# Altium project Street_light_LED.PrjPcb
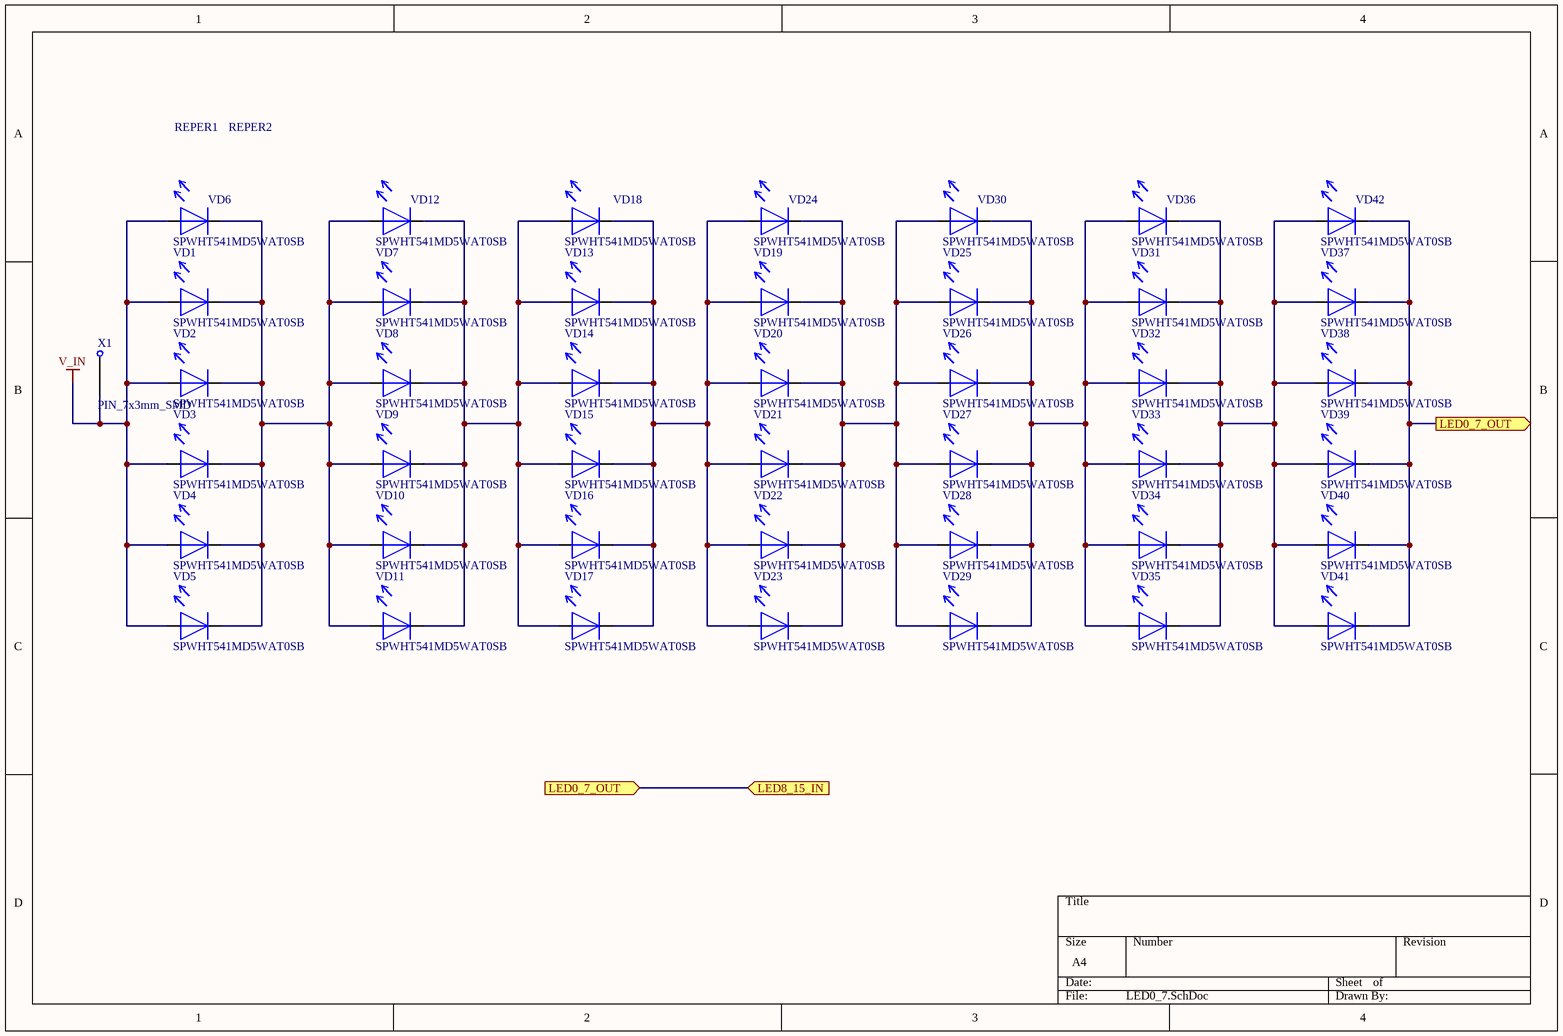
[diagram p0: LED0_7.SchDoc]
4 sheets, 160 parts. Net scope: flat (ports and power ports of the same name join across sheets).
Board file: Street_light_LED.PcbDoc
Sheets:
  LED0_7.SchDoc
  LED8_15.SchDoc
  LED16_23.SchDoc
  LED24_26.SchDoc

## Sheet LED0_7.SchDoc
size A4

### Parts
REPER1  REPER1.2  [REPER1.2]  (value not drawn)
REPER2  REPER1.2  [REPER1.2]  (value not drawn)
VD1  SPWHT541MD5WAT0SB  [LED_SAMSUNG]
VD2  SPWHT541MD5WAT0SB  [LED_SAMSUNG]
VD3  SPWHT541MD5WAT0SB  [LED_SAMSUNG]
VD4  SPWHT541MD5WAT0SB  [LED_SAMSUNG]
VD5  SPWHT541MD5WAT0SB  [LED_SAMSUNG]
VD6  SPWHT541MD5WAT0SB  [LED_SAMSUNG]
VD7  SPWHT541MD5WAT0SB  [LED_SAMSUNG]
VD8  SPWHT541MD5WAT0SB  [LED_SAMSUNG]
VD9  SPWHT541MD5WAT0SB  [LED_SAMSUNG]
VD10  SPWHT541MD5WAT0SB  [LED_SAMSUNG]
VD11  SPWHT541MD5WAT0SB  [LED_SAMSUNG]
VD12  SPWHT541MD5WAT0SB  [LED_SAMSUNG]
VD13  SPWHT541MD5WAT0SB  [LED_SAMSUNG]
VD14  SPWHT541MD5WAT0SB  [LED_SAMSUNG]
VD15  SPWHT541MD5WAT0SB  [LED_SAMSUNG]
VD16  SPWHT541MD5WAT0SB  [LED_SAMSUNG]
VD17  SPWHT541MD5WAT0SB  [LED_SAMSUNG]
VD18  SPWHT541MD5WAT0SB  [LED_SAMSUNG]
VD19  SPWHT541MD5WAT0SB  [LED_SAMSUNG]
VD20  SPWHT541MD5WAT0SB  [LED_SAMSUNG]
VD21  SPWHT541MD5WAT0SB  [LED_SAMSUNG]
VD22  SPWHT541MD5WAT0SB  [LED_SAMSUNG]
VD23  SPWHT541MD5WAT0SB  [LED_SAMSUNG]
VD24  SPWHT541MD5WAT0SB  [LED_SAMSUNG]
VD25  SPWHT541MD5WAT0SB  [LED_SAMSUNG]
VD26  SPWHT541MD5WAT0SB  [LED_SAMSUNG]
VD27  SPWHT541MD5WAT0SB  [LED_SAMSUNG]
VD28  SPWHT541MD5WAT0SB  [LED_SAMSUNG]
VD29  SPWHT541MD5WAT0SB  [LED_SAMSUNG]
VD30  SPWHT541MD5WAT0SB  [LED_SAMSUNG]
VD31  SPWHT541MD5WAT0SB  [LED_SAMSUNG]
VD32  SPWHT541MD5WAT0SB  [LED_SAMSUNG]
VD33  SPWHT541MD5WAT0SB  [LED_SAMSUNG]
VD34  SPWHT541MD5WAT0SB  [LED_SAMSUNG]
VD35  SPWHT541MD5WAT0SB  [LED_SAMSUNG]
VD36  SPWHT541MD5WAT0SB  [LED_SAMSUNG]
VD37  SPWHT541MD5WAT0SB  [LED_SAMSUNG]
VD38  SPWHT541MD5WAT0SB  [LED_SAMSUNG]
VD39  SPWHT541MD5WAT0SB  [LED_SAMSUNG]
VD40  SPWHT541MD5WAT0SB  [LED_SAMSUNG]
VD41  SPWHT541MD5WAT0SB  [LED_SAMSUNG]
VD42  SPWHT541MD5WAT0SB  [LED_SAMSUNG]
X1  PIN_7x3mm_SMD  [PIN_7x3mm_SMD]

### Ports
LED0_7_OUT (in), LED0_7_OUT (out), LED8_15_IN (in)

### Nets
V_IN: VD1.1 VD2.1 VD3.1 VD4.1 VD5.1 VD6.1 X1.1
NetVD1_2: VD1.2 VD2.2 VD3.2 VD4.2 VD5.2 VD6.2 VD7.1 VD8.1 VD9.1 VD10.1 VD11.1 VD12.1
NetVD7_2: VD7.2 VD8.2 VD9.2 VD10.2 VD11.2 VD12.2 VD13.1 VD14.1 VD15.1 VD16.1 VD17.1 VD18.1
NetVD13_2: VD13.2 VD14.2 VD15.2 VD16.2 VD17.2 VD18.2 VD19.1 VD20.1 VD21.1 VD22.1 VD23.1 VD24.1
NetVD19_2: VD19.2 VD20.2 VD21.2 VD22.2 VD23.2 VD24.2 VD25.1 VD26.1 VD27.1 VD28.1 VD29.1 VD30.1
NetVD25_2: VD25.2 VD26.2 VD27.2 VD28.2 VD29.2 VD30.2 VD31.1 VD32.1 VD33.1 VD34.1 VD35.1 VD36.1
NetVD31_2: VD31.2 VD32.2 VD33.2 VD34.2 VD35.2 VD36.2 VD37.1 VD38.1 VD39.1 VD40.1 VD41.1 VD42.1
NetVD37_2: VD37.2 VD38.2 VD39.2 VD40.2 VD41.2 VD42.2 ; port LED0_7_OUT, port LED8_15_IN

Not connected (* = marked no-connect by the designer): REPER1 1; REPER2 1

### Library data of the parts
VD1-VD42 = LED SPWHT541MD5WAT0SB: Value: SPWHT541MD5WAT0SB
REPER1 REPER2 = REPER1.2: Value: *

## Sheet LED8_15.SchDoc
size A4
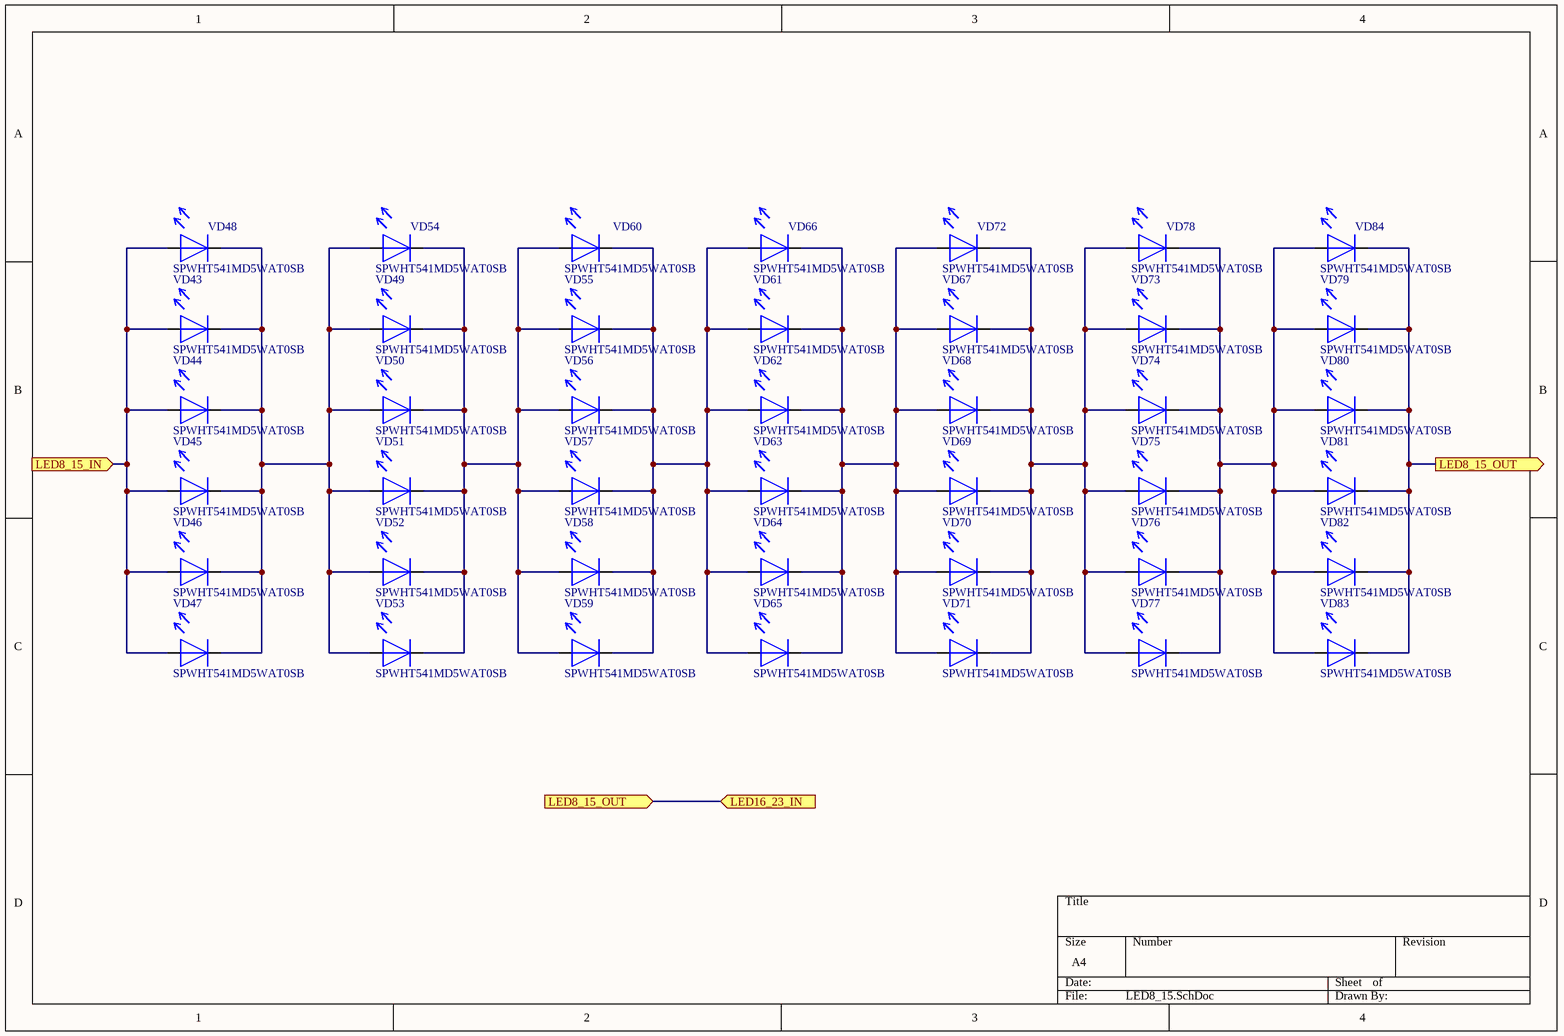
[diagram p1: LED8_15.SchDoc]

### Parts
VD43  SPWHT541MD5WAT0SB  [LED_SAMSUNG]
VD44  SPWHT541MD5WAT0SB  [LED_SAMSUNG]
VD45  SPWHT541MD5WAT0SB  [LED_SAMSUNG]
VD46  SPWHT541MD5WAT0SB  [LED_SAMSUNG]
VD47  SPWHT541MD5WAT0SB  [LED_SAMSUNG]
VD48  SPWHT541MD5WAT0SB  [LED_SAMSUNG]
VD49  SPWHT541MD5WAT0SB  [LED_SAMSUNG]
VD50  SPWHT541MD5WAT0SB  [LED_SAMSUNG]
VD51  SPWHT541MD5WAT0SB  [LED_SAMSUNG]
VD52  SPWHT541MD5WAT0SB  [LED_SAMSUNG]
VD53  SPWHT541MD5WAT0SB  [LED_SAMSUNG]
VD54  SPWHT541MD5WAT0SB  [LED_SAMSUNG]
VD55  SPWHT541MD5WAT0SB  [LED_SAMSUNG]
VD56  SPWHT541MD5WAT0SB  [LED_SAMSUNG]
VD57  SPWHT541MD5WAT0SB  [LED_SAMSUNG]
VD58  SPWHT541MD5WAT0SB  [LED_SAMSUNG]
VD59  SPWHT541MD5WAT0SB  [LED_SAMSUNG]
VD60  SPWHT541MD5WAT0SB  [LED_SAMSUNG]
VD61  SPWHT541MD5WAT0SB  [LED_SAMSUNG]
VD62  SPWHT541MD5WAT0SB  [LED_SAMSUNG]
VD63  SPWHT541MD5WAT0SB  [LED_SAMSUNG]
VD64  SPWHT541MD5WAT0SB  [LED_SAMSUNG]
VD65  SPWHT541MD5WAT0SB  [LED_SAMSUNG]
VD66  SPWHT541MD5WAT0SB  [LED_SAMSUNG]
VD67  SPWHT541MD5WAT0SB  [LED_SAMSUNG]
VD68  SPWHT541MD5WAT0SB  [LED_SAMSUNG]
VD69  SPWHT541MD5WAT0SB  [LED_SAMSUNG]
VD70  SPWHT541MD5WAT0SB  [LED_SAMSUNG]
VD71  SPWHT541MD5WAT0SB  [LED_SAMSUNG]
VD72  SPWHT541MD5WAT0SB  [LED_SAMSUNG]
VD73  SPWHT541MD5WAT0SB  [LED_SAMSUNG]
VD74  SPWHT541MD5WAT0SB  [LED_SAMSUNG]
VD75  SPWHT541MD5WAT0SB  [LED_SAMSUNG]
VD76  SPWHT541MD5WAT0SB  [LED_SAMSUNG]
VD77  SPWHT541MD5WAT0SB  [LED_SAMSUNG]
VD78  SPWHT541MD5WAT0SB  [LED_SAMSUNG]
VD79  SPWHT541MD5WAT0SB  [LED_SAMSUNG]
VD80  SPWHT541MD5WAT0SB  [LED_SAMSUNG]
VD81  SPWHT541MD5WAT0SB  [LED_SAMSUNG]
VD82  SPWHT541MD5WAT0SB  [LED_SAMSUNG]
VD83  SPWHT541MD5WAT0SB  [LED_SAMSUNG]
VD84  SPWHT541MD5WAT0SB  [LED_SAMSUNG]

### Ports
LED8_15_IN (in), LED8_15_OUT (in), LED8_15_OUT (out), LED16_23_IN (in)

### Nets
NetVD37_2: VD43.1 VD44.1 VD45.1 VD46.1 VD47.1 VD48.1 ; port LED8_15_IN
NetVD43_2: VD43.2 VD44.2 VD45.2 VD46.2 VD47.2 VD48.2 VD49.1 VD50.1 VD51.1 VD52.1 VD53.1 VD54.1
NetVD49_2: VD49.2 VD50.2 VD51.2 VD52.2 VD53.2 VD54.2 VD55.1 VD56.1 VD57.1 VD58.1 VD59.1 VD60.1
NetVD55_2: VD55.2 VD56.2 VD57.2 VD58.2 VD59.2 VD60.2 VD61.1 VD62.1 VD63.1 VD64.1 VD65.1 VD66.1
NetVD61_2: VD61.2 VD62.2 VD63.2 VD64.2 VD65.2 VD66.2 VD67.1 VD68.1 VD69.1 VD70.1 VD71.1 VD72.1
NetVD67_2: VD67.2 VD68.2 VD69.2 VD70.2 VD71.2 VD72.2 VD73.1 VD74.1 VD75.1 VD76.1 VD77.1 VD78.1
NetVD73_2: VD73.2 VD74.2 VD75.2 VD76.2 VD77.2 VD78.2 VD79.1 VD80.1 VD81.1 VD82.1 VD83.1 VD84.1
NetVD79_2: VD79.2 VD80.2 VD81.2 VD82.2 VD83.2 VD84.2 ; port LED8_15_OUT, port LED16_23_IN

### Library data of the parts
VD43-VD84 = LED SPWHT541MD5WAT0SB: Value: SPWHT541MD5WAT0SB

## Sheet LED16_23.SchDoc
size A4
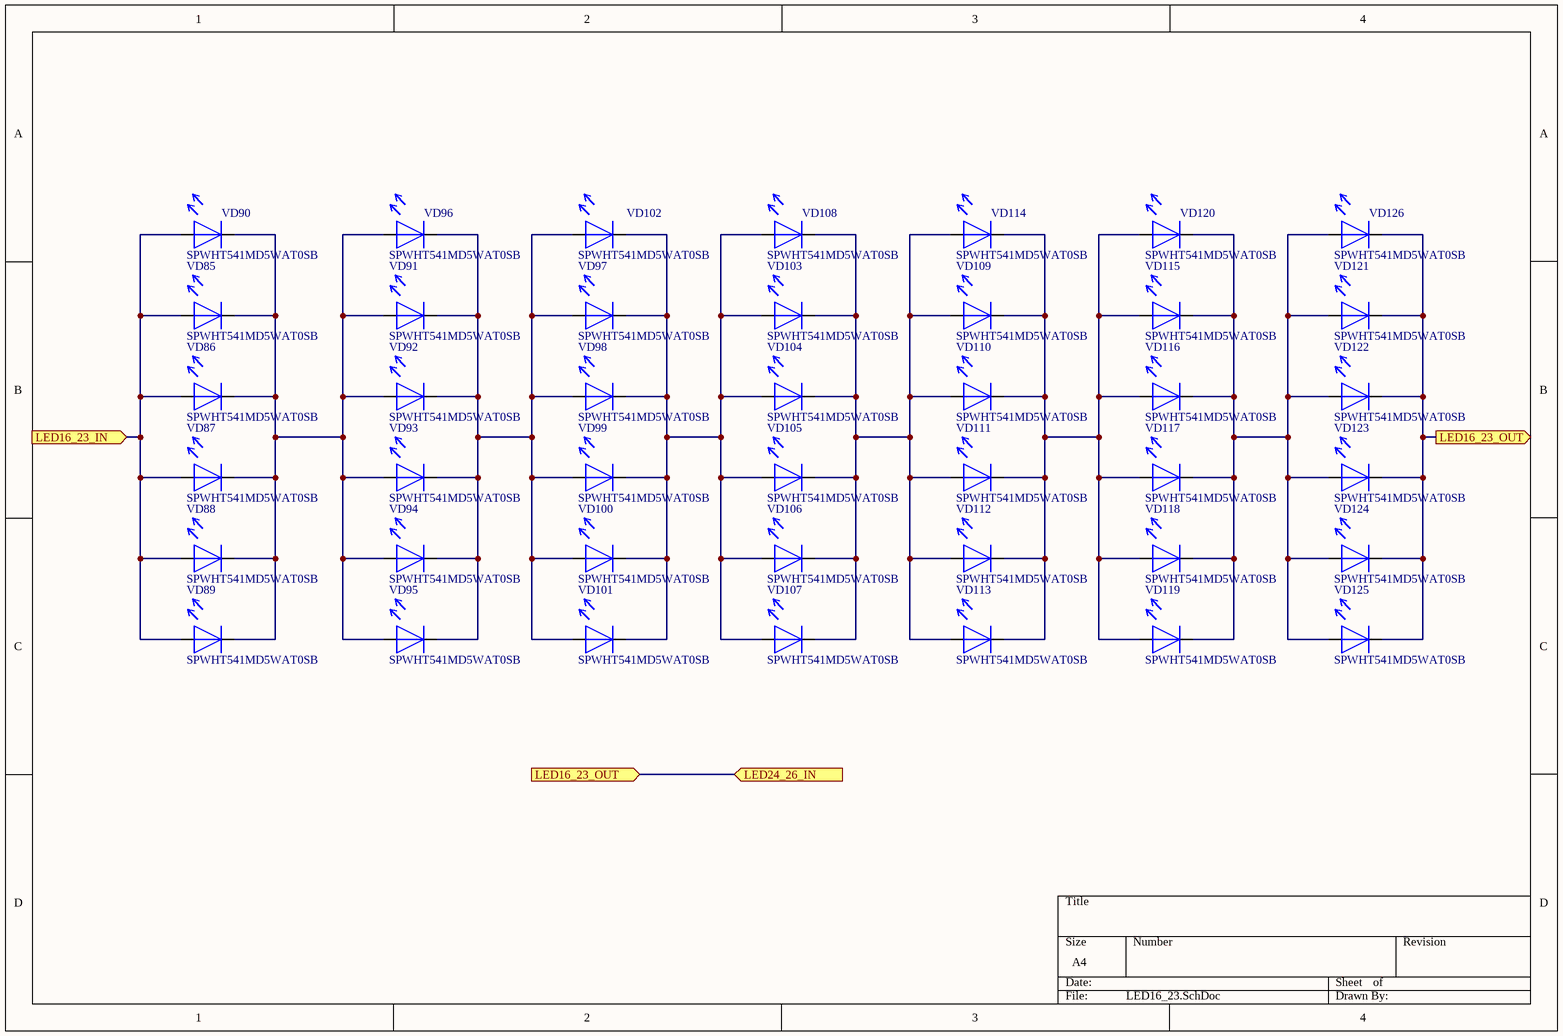
[diagram p2: LED16_23.SchDoc]

### Parts
VD85  SPWHT541MD5WAT0SB  [LED_SAMSUNG]
VD86  SPWHT541MD5WAT0SB  [LED_SAMSUNG]
VD87  SPWHT541MD5WAT0SB  [LED_SAMSUNG]
VD88  SPWHT541MD5WAT0SB  [LED_SAMSUNG]
VD89  SPWHT541MD5WAT0SB  [LED_SAMSUNG]
VD90  SPWHT541MD5WAT0SB  [LED_SAMSUNG]
VD91  SPWHT541MD5WAT0SB  [LED_SAMSUNG]
VD92  SPWHT541MD5WAT0SB  [LED_SAMSUNG]
VD93  SPWHT541MD5WAT0SB  [LED_SAMSUNG]
VD94  SPWHT541MD5WAT0SB  [LED_SAMSUNG]
VD95  SPWHT541MD5WAT0SB  [LED_SAMSUNG]
VD96  SPWHT541MD5WAT0SB  [LED_SAMSUNG]
VD97  SPWHT541MD5WAT0SB  [LED_SAMSUNG]
VD98  SPWHT541MD5WAT0SB  [LED_SAMSUNG]
VD99  SPWHT541MD5WAT0SB  [LED_SAMSUNG]
VD100  SPWHT541MD5WAT0SB  [LED_SAMSUNG]
VD101  SPWHT541MD5WAT0SB  [LED_SAMSUNG]
VD102  SPWHT541MD5WAT0SB  [LED_SAMSUNG]
VD103  SPWHT541MD5WAT0SB  [LED_SAMSUNG]
VD104  SPWHT541MD5WAT0SB  [LED_SAMSUNG]
VD105  SPWHT541MD5WAT0SB  [LED_SAMSUNG]
VD106  SPWHT541MD5WAT0SB  [LED_SAMSUNG]
VD107  SPWHT541MD5WAT0SB  [LED_SAMSUNG]
VD108  SPWHT541MD5WAT0SB  [LED_SAMSUNG]
VD109  SPWHT541MD5WAT0SB  [LED_SAMSUNG]
VD110  SPWHT541MD5WAT0SB  [LED_SAMSUNG]
VD111  SPWHT541MD5WAT0SB  [LED_SAMSUNG]
VD112  SPWHT541MD5WAT0SB  [LED_SAMSUNG]
VD113  SPWHT541MD5WAT0SB  [LED_SAMSUNG]
VD114  SPWHT541MD5WAT0SB  [LED_SAMSUNG]
VD115  SPWHT541MD5WAT0SB  [LED_SAMSUNG]
VD116  SPWHT541MD5WAT0SB  [LED_SAMSUNG]
VD117  SPWHT541MD5WAT0SB  [LED_SAMSUNG]
VD118  SPWHT541MD5WAT0SB  [LED_SAMSUNG]
VD119  SPWHT541MD5WAT0SB  [LED_SAMSUNG]
VD120  SPWHT541MD5WAT0SB  [LED_SAMSUNG]
VD121  SPWHT541MD5WAT0SB  [LED_SAMSUNG]
VD122  SPWHT541MD5WAT0SB  [LED_SAMSUNG]
VD123  SPWHT541MD5WAT0SB  [LED_SAMSUNG]
VD124  SPWHT541MD5WAT0SB  [LED_SAMSUNG]
VD125  SPWHT541MD5WAT0SB  [LED_SAMSUNG]
VD126  SPWHT541MD5WAT0SB  [LED_SAMSUNG]

### Ports
LED16_23_IN (in), LED16_23_OUT (in), LED16_23_OUT (out), LED24_26_IN (in)

### Nets
NetVD79_2: VD85.1 VD86.1 VD87.1 VD88.1 VD89.1 VD90.1 ; port LED16_23_IN
NetVD85_2: VD85.2 VD86.2 VD87.2 VD88.2 VD89.2 VD90.2 VD91.1 VD92.1 VD93.1 VD94.1 VD95.1 VD96.1
NetVD91_2: VD91.2 VD92.2 VD93.2 VD94.2 VD95.2 VD96.2 VD97.1 VD98.1 VD99.1 VD100.1 VD101.1 VD102.1
NetVD97_2: VD97.2 VD98.2 VD99.2 VD100.2 VD101.2 VD102.2 VD103.1 VD104.1 VD105.1 VD106.1 VD107.1 VD108.1
NetVD103_2: VD103.2 VD104.2 VD105.2 VD106.2 VD107.2 VD108.2 VD109.1 VD110.1 VD111.1 VD112.1 VD113.1 VD114.1
NetVD109_2: VD109.2 VD110.2 VD111.2 VD112.2 VD113.2 VD114.2 VD115.1 VD116.1 VD117.1 VD118.1 VD119.1 VD120.1
NetVD115_2: VD115.2 VD116.2 VD117.2 VD118.2 VD119.2 VD120.2 VD121.1 VD122.1 VD123.1 VD124.1 VD125.1 VD126.1
NetVD121_2: VD121.2 VD122.2 VD123.2 VD124.2 VD125.2 VD126.2 ; port LED16_23_OUT, port LED24_26_IN

### Library data of the parts
VD85-VD126 = LED SPWHT541MD5WAT0SB: Value: SPWHT541MD5WAT0SB

## Sheet LED24_26.SchDoc
size A4
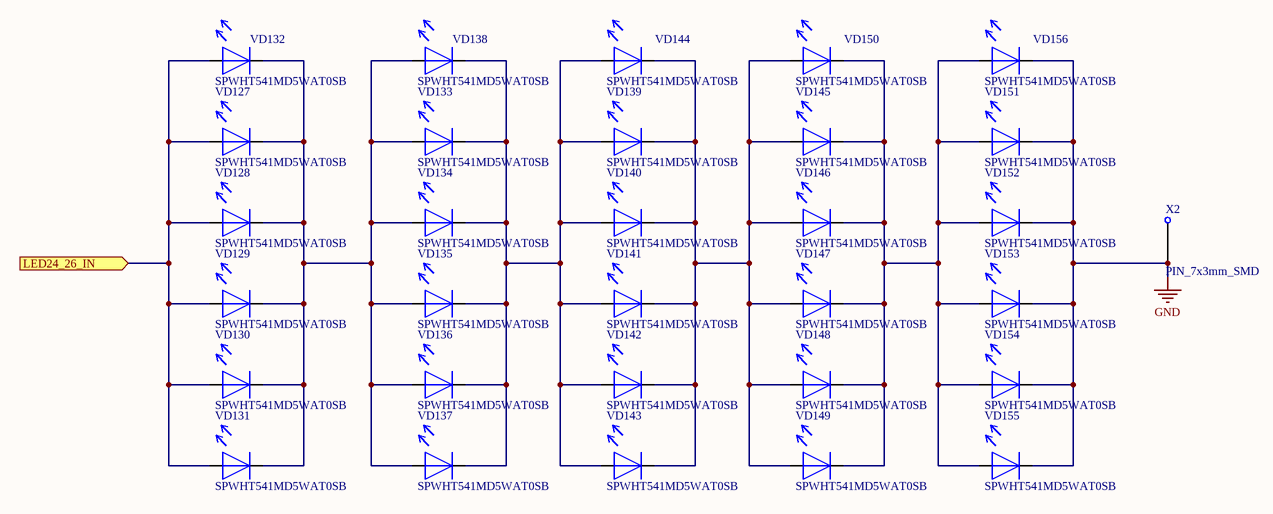
[diagram p3: LED24_26.SchDoc]

### Parts
VD127  SPWHT541MD5WAT0SB  [LED_SAMSUNG]
VD128  SPWHT541MD5WAT0SB  [LED_SAMSUNG]
VD129  SPWHT541MD5WAT0SB  [LED_SAMSUNG]
VD130  SPWHT541MD5WAT0SB  [LED_SAMSUNG]
VD131  SPWHT541MD5WAT0SB  [LED_SAMSUNG]
VD132  SPWHT541MD5WAT0SB  [LED_SAMSUNG]
VD133  SPWHT541MD5WAT0SB  [LED_SAMSUNG]
VD134  SPWHT541MD5WAT0SB  [LED_SAMSUNG]
VD135  SPWHT541MD5WAT0SB  [LED_SAMSUNG]
VD136  SPWHT541MD5WAT0SB  [LED_SAMSUNG]
VD137  SPWHT541MD5WAT0SB  [LED_SAMSUNG]
VD138  SPWHT541MD5WAT0SB  [LED_SAMSUNG]
VD139  SPWHT541MD5WAT0SB  [LED_SAMSUNG]
VD140  SPWHT541MD5WAT0SB  [LED_SAMSUNG]
VD141  SPWHT541MD5WAT0SB  [LED_SAMSUNG]
VD142  SPWHT541MD5WAT0SB  [LED_SAMSUNG]
VD143  SPWHT541MD5WAT0SB  [LED_SAMSUNG]
VD144  SPWHT541MD5WAT0SB  [LED_SAMSUNG]
VD145  SPWHT541MD5WAT0SB  [LED_SAMSUNG]
VD146  SPWHT541MD5WAT0SB  [LED_SAMSUNG]
VD147  SPWHT541MD5WAT0SB  [LED_SAMSUNG]
VD148  SPWHT541MD5WAT0SB  [LED_SAMSUNG]
VD149  SPWHT541MD5WAT0SB  [LED_SAMSUNG]
VD150  SPWHT541MD5WAT0SB  [LED_SAMSUNG]
VD151  SPWHT541MD5WAT0SB  [LED_SAMSUNG]
VD152  SPWHT541MD5WAT0SB  [LED_SAMSUNG]
VD153  SPWHT541MD5WAT0SB  [LED_SAMSUNG]
VD154  SPWHT541MD5WAT0SB  [LED_SAMSUNG]
VD155  SPWHT541MD5WAT0SB  [LED_SAMSUNG]
VD156  SPWHT541MD5WAT0SB  [LED_SAMSUNG]
X2  PIN_7x3mm_SMD  [PIN_7x3mm_SMD]

### Ports
LED24_26_IN (in)

### Nets
GND: VD151.2 VD152.2 VD153.2 VD154.2 VD155.2 VD156.2 X2.1
NetVD121_2: VD127.1 VD128.1 VD129.1 VD130.1 VD131.1 VD132.1 ; port LED24_26_IN
NetVD127_2: VD127.2 VD128.2 VD129.2 VD130.2 VD131.2 VD132.2 VD133.1 VD134.1 VD135.1 VD136.1 VD137.1 VD138.1
NetVD133_2: VD133.2 VD134.2 VD135.2 VD136.2 VD137.2 VD138.2 VD139.1 VD140.1 VD141.1 VD142.1 VD143.1 VD144.1
NetVD139_2: VD139.2 VD140.2 VD141.2 VD142.2 VD143.2 VD144.2 VD145.1 VD146.1 VD147.1 VD148.1 VD149.1 VD150.1
NetVD145_2: VD145.2 VD146.2 VD147.2 VD148.2 VD149.2 VD150.2 VD151.1 VD152.1 VD153.1 VD154.1 VD155.1 VD156.1

### Library data of the parts
VD127-VD156 = LED SPWHT541MD5WAT0SB: Value: SPWHT541MD5WAT0SB

## Nets that join several sheets
NetVD37_2: LED0_7 (6 pins), LED8_15 (6 pins)
NetVD79_2: LED8_15 (6 pins), LED16_23 (6 pins)
NetVD121_2: LED16_23 (6 pins), LED24_26 (6 pins)